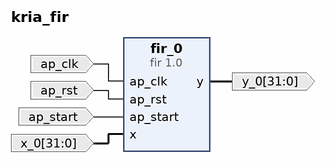
[diagram p0: block diagram of the top level]
# Vivado block design kria_fir, xck26-sfvc784-2LV-c, Vivado 2022.2
create_bd_design kria_fir

create_bd_port -dir I -from 31 -to 0 -type data x_0
create_bd_port -dir O -from 31 -to 0 -type data y_0
create_bd_port -dir I ap_start
create_bd_port -dir I -type clk ap_clk
set_property -dict {CONFIG.FREQ_HZ 500} [get_bd_ports ap_clk]
create_bd_port -dir I -type rst ap_rst
set_property -dict {CONFIG.POLARITY ACTIVE_HIGH} [get_bd_ports ap_rst]

create_bd_cell -type ip -vlnv Fabian:hls:fir:1.0 fir_0

# ---- connections ----

connect_bd_net -net ap_clk_0_1 [get_bd_ports ap_clk] [get_bd_pins fir_0/ap_clk]
connect_bd_net -net ap_rst_0_1 [get_bd_ports ap_rst] [get_bd_pins fir_0/ap_rst]
connect_bd_net -net ap_start_0_1 [get_bd_ports ap_start] [get_bd_pins fir_0/ap_start]
connect_bd_net [get_bd_pins fir_0/y] [get_bd_ports y_0]
connect_bd_net -net x_0_1 [get_bd_ports x_0] [get_bd_pins fir_0/x]

validate_bd_design
save_bd_design
